# EasyEDA Pro project ProProject_Driver_STM32F031_2023-10-07.epro, board PCB1
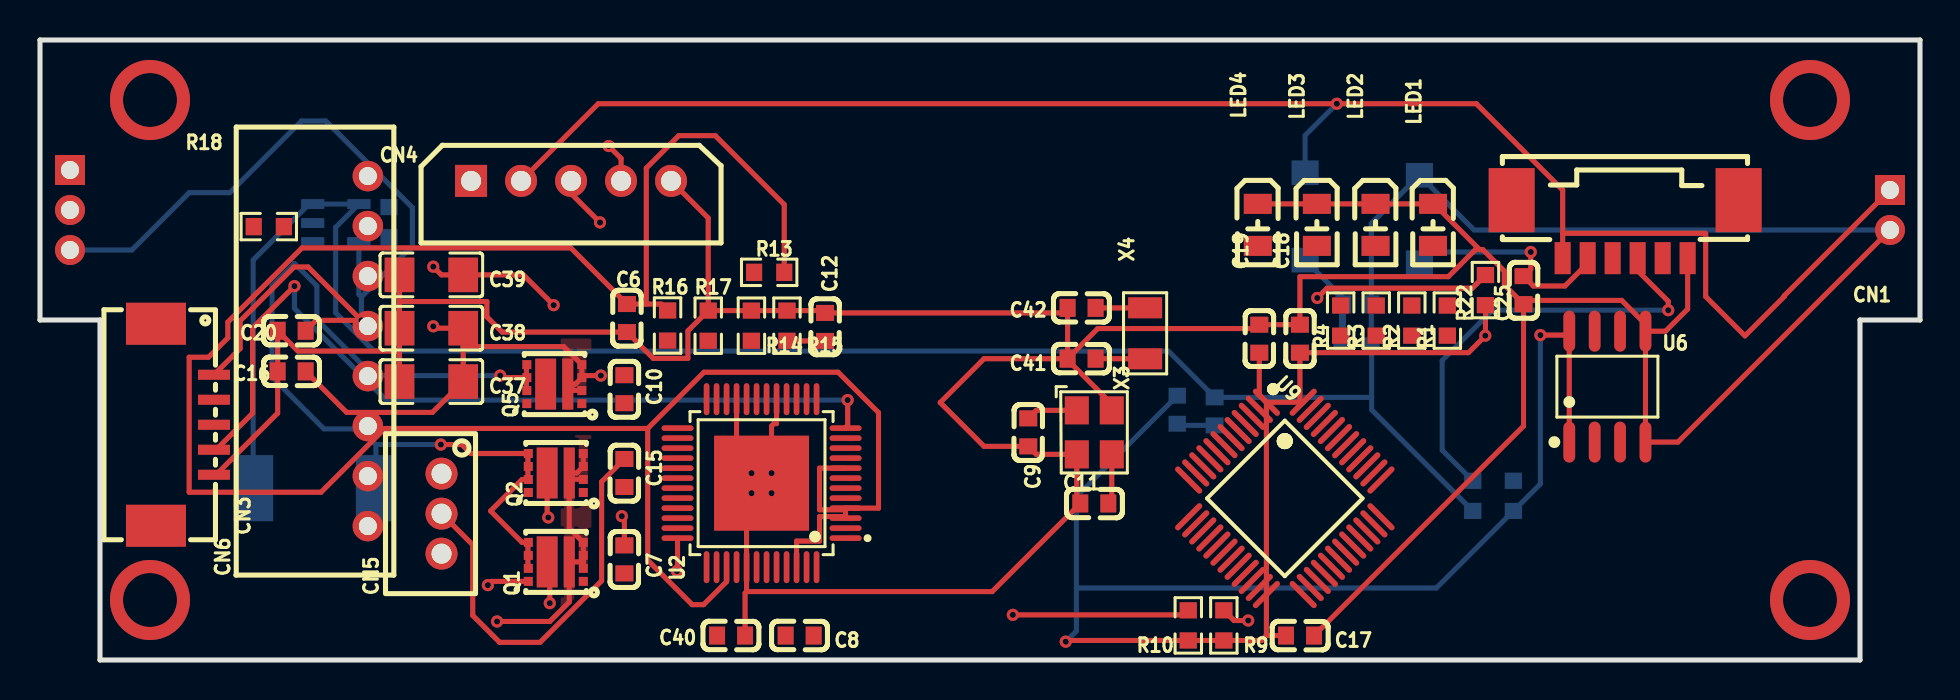
[diagram p8: board, top side]
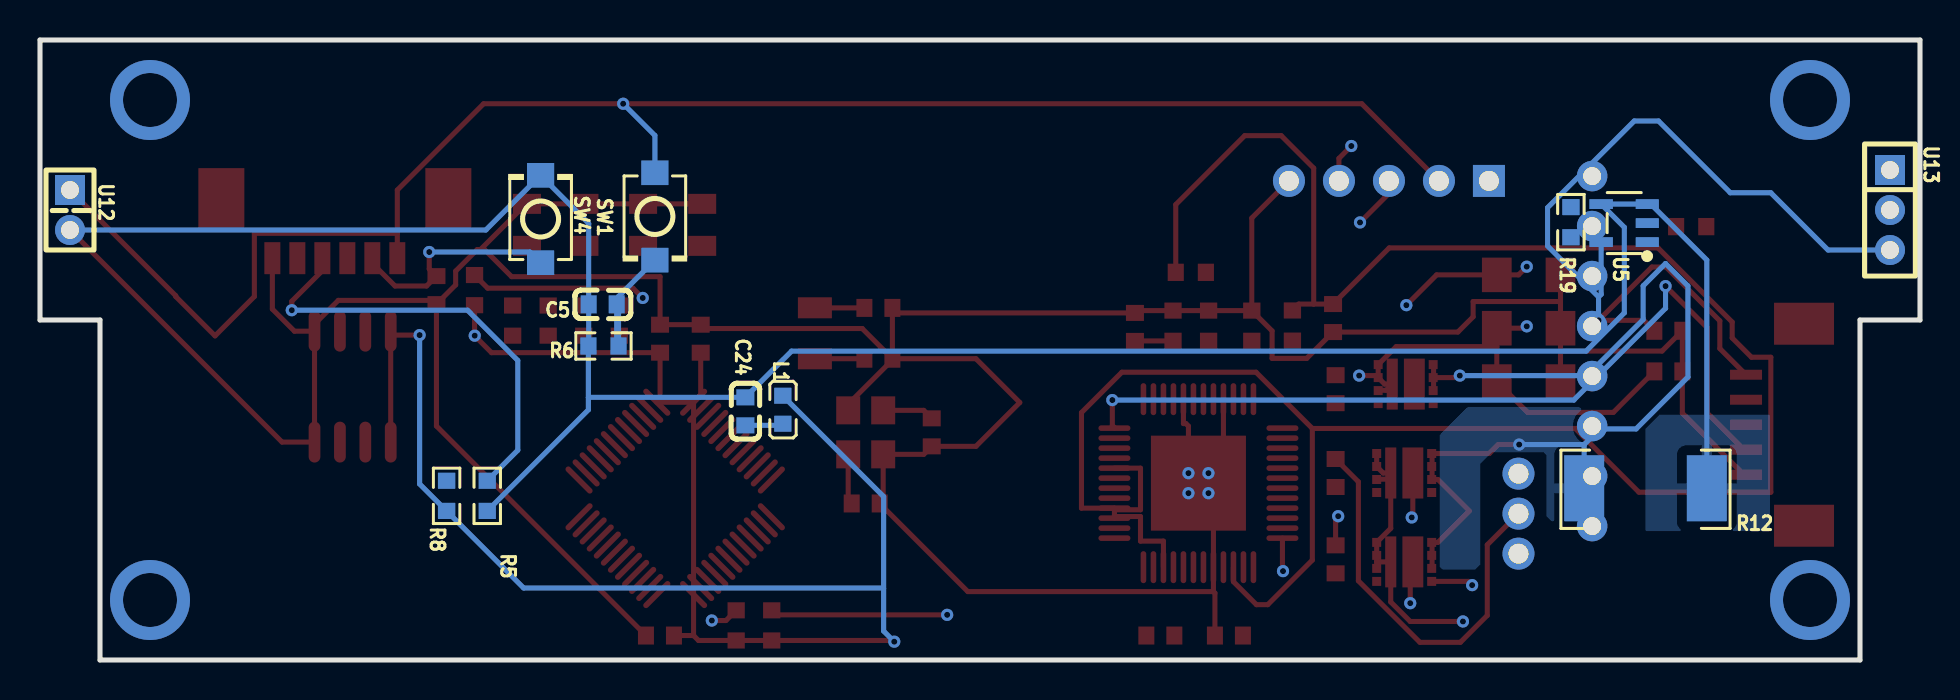
[diagram p9: board, bottom side, seen from below]

Outline 94 x 31 mm; copper layers: Top Layer, Inner1, Inner2, Bottom Layer. Coordinates in mm from the lower left corner of the outline.
Outline path: 0,31 94,31 94,17 91,17 91,0 3,0 3,17 0,17 0,31
Stack: Top Layer 0.035mm / Dielectric1 0.48mm PP er 4.5 / Inner1 0.035mm / Dielectric2 0.48mm FR4 er 4.5 / Inner2 0.035mm / Dielectric3 0.48mm PP er 4.5 / Bottom Layer 0.035mm

## Design rules (mm)
spacing safeClearance (default): track to track 0.152, other pairs 0.152 to 0.3
track width trackWidth (default): min 0.127, default 0.254, max 2.54
differential pair differentialPair (default): width min 0.127, default 0.254, max 2.54; gap min 0.152, default 0.152
via viaSize (default): diameter min 0.5, default 0.61, max 10; hole min 0.3, default 0.305, max 6
net GND uses copperRegion1
net VCC uses copperRegion1
net GND_CS uses copperRegion1
net +16V uses copperRegion1

## Placement (name value [footprint] x y rotation side)
C5  100nF  [C0603]  65.87 17.78 0 bottom
C6  1uF  [C0603]  29.35 17.1 90 top
C7  33nF  [C0603]  29.22 5.03 90 top
C8  470nF  [C0603]  37.98 1.22 0 top
C9  20pF  [C0603]  49.41 11.38 90 top
C10  33nF  [C0603]  29.22 13.54 90 top
C11  20pF  [C0603]  52.72 7.83 180 top
C12  1nF  [C0603]  39.25 16.65 270 top
C15  33nF  [C0603]  29.22 9.35 90 top
C16  10uF  [C0603]  12.58 14.43 0 top
C17  100nF  [C0603]  63 1.22 180 top
C18  100nF  [C0603]  63 16.07 270 top
C19  100nF  [C0603]  60.96 16.07 270 top
C20  4.7uF  [C0603]  12.58 16.46 0 top
C24  100nF  [C0603]  58.73 12.43 270 bottom
C25  100nF  [C0603]  74.18 18.49 90 top
C37  10uF  [C1206]  19.57 13.92 0 top
C38  10uF  [C1206]  19.57 16.59 0 top
C39  10uF  [C1206]  19.57 19.26 0 top
C40  1uF  [C0603]  34.55 1.22 0 top
C41  22pF  [C0603]  52.08 15.06 0 top
C42  22pF  [C0603]  52.08 17.61 0 top
CN1  532610671  [CONN-SMD_6P-P1.25_53261-0671]  79.26 21.54 180 top
CN3  1.25-5P WT  [CONN-SMD_1.25-5PWT]  7.25 11.76 90 top
CN4  5264-5A  [CONN-TH_5264-5A]  26.55 23.95 0 top
CN5  B3B-PH-K-S(LF)(SN)  [CONN-TH_B3B-PH-K-S]  20.08 7.32 90 top
CN6  22057085  [CONN-TH_8P-P2.50_MOLEX_22057085]  16.39 15.45 90 top
L1  3.3uH  [L0603]  56.86 12.51 270 bottom
LED1  SZYY0805B  [LED0805-R-RD_BLUE]  69.65 21.76 270 top
LED2  SZYY0805B  [LED0805-R-RD_BLUE]  66.78 21.76 270 top
LED3  SZYY0805B  [LED0805-R-RD_BLUE]  63.84 21.76 270 top
LED4  SZYY0805B  [LED0805-R-RD_BLUE]  60.89 21.76 270 top
Q1  DMT3009LDT-7  [V-DFN3030-8K_L3.0-W3.0-P0.65-BL]  25.79 4.91 90 top
Q2  DMT3009LDT-7  [V-DFN3030-8K_L3.0-W3.0-P0.65-BL]  25.79 9.35 90 top
Q5  DMT3009LDT-7  [V-DFN3030-8K_L3.0-W3.0-P0.65-BL]  25.72 13.8 90 top
R1  1kΩ  [R0603]  70.37 16.97 270 top
R2  1kΩ  [R0603]  68.59 16.97 270 top
R3  1kΩ  [R0603]  66.81 16.97 270 top
R4  1kΩ  [R0603]  65.03 16.97 270 top
R5  10kΩ  [R0603]  71.64 8.21 90 bottom
R6  10kΩ  [R0603]  65.83 15.7 0 bottom
R8  10kΩ  [R0603]  73.67 8.21 90 bottom
R9  1kΩ  [R0603]  59.19 1.73 90 top
R10  1kΩ  [R0603]  57.41 1.73 90 top
R12  25mΩ  [RES-SMD_L6.4-W3.2-R2512]  13.73 8.59 0 bottom
R13  47kΩ  [R0603]  37.35 16.72 270 top
R14  10kΩ  [R0603]  35.57 16.72 90 top
R15  100kΩ  [R0603]  36.46 19.38 180 top
R16  100kΩ  [R0603]  31.38 16.72 270 top
R17  10kΩ  [R0603]  33.41 16.72 270 top
R18  1kΩ  [R0603]  11.44 21.67 0 top
R19  1kΩ  [R0603]  17.45 21.89 90 bottom
R22  10kΩ  [R0603]  72.27 18.49 270 top
SW1  TS-1088-AR02016  [SW-SMD_L3.9-W3.0-P4.45]  63.26 22.18 270 bottom
SW4  TS-1088-AR02016  [SW-SMD_L3.9-W3.0-P4.45]  68.97 22.05 90 bottom
U2  A3930KJPTR-T  [LQFP-48_L7.0-W7.0-P0.50-LS9.0-BL-EP]  36.08 8.84 90 top
U5  TPS7B6950DBVR  [SOT-23-5_L3.0-W1.7-P0.95-LS2.8-BL]  14.79 21.84 90 bottom
U6  π122U31  [SOIC-8_L4.9-W3.9-P1.27-LS6.0-BL]  78.37 13.67 0 top
U9  STM32F031C6T6TR  [LQFP-48_L7.0-W7.0-P0.50-LS9.0-TL]  62.24 8.08 315 top
U12  DW200R-11-02-43  [HDR-TH_2P-P2.00-V-F]  92.5 22.5 270 bottom
U13  PM200-1-03-Z-4.3  [HDR-TH_3P-P2.00-V-F-A]  1.5 22.5 270 bottom
X3  8MHz  [OSC-SMD_4P-L3.2-W2.5-BL]  52.72 11.38 270 top
X4  32.768kHz  [CRYSTAL-SMD_L3.2-W1.5-1]  55.25 16.33 90 top

## Footprints (pads in the part's own frame, mm; a bottom-side part is the same pattern mirrored in y, then rotated)
C0603
  rect 0.8x0.9 smd: 1(-0.7,0) 2(0.7,0)
C1206
  rect 1.485x1.728 smd: 1(-1.593,0) 2(1.593,0)
CONN-SMD_1.25-5PWT
  rect 0.5x1.6 smd: 1(2.5,-1.45) 2(1.25,-1.45) 3(0,-1.45) 4(-1.25,-1.45) 5(-2.5,-1.45)
  rect 2.1x3 smd: 6(5.05,1.45) 7(-5.05,1.45)
CONN-SMD_6P-P1.25_53261-0671
  rect 0.8x1.6 smd: 1(3.124,1.45) 2(1.875,1.45) 3(0.625,1.45) 4(-0.625,1.45) 5(-1.875,1.45) 6(-3.124,1.45)
  rect 2.301x3.2 smd: 7(-5.675,-1.45) 8(5.675,-1.45)
CONN-TH_8P-P2.50_MOLEX_22057085
  round 1.524 hole 0.9: 1(-8.75,0) 2(-6.25,0) 3(-3.75,0) 4(-1.25,0) 5(1.25,0) 6(3.75,0) 7(6.25,0) 8(8.75,0)
CONN-TH_5264-5A
  rect 1.6x1.6 hole 1: 1(-5,0)
  round 1.6 hole 1: 2(-2.5,0) 3(0,0) 4(2.5,0) 5(5,0)
CONN-TH_B3B-PH-K-S
  round 1.6 hole 1: 1(2,0) 2(0,0) 3(-2,0)
CRYSTAL-SMD_L3.2-W1.5-1
  rect 1.05x1.7 smd: 1(-1.275,0) 2(1.275,0)
HDR-TH_2P-P2.00-V-F
  rect 1.5x1.5 hole 0.9: 1(-1,0)
  round 1.5 hole 0.9: 2(1,0)
HDR-TH_3P-P2.00-V-F-A
  rect 1.5x1.5 hole 0.9: 1(-2,0)
  round 1.5 hole 0.9: 2(0,0) 3(2,0)
L0603
  rect 0.8x0.864 smd: 1(-0.7,0) 2(0.7,0)
LED0805-R-RD_BLUE
  rect 1.001x1.399 smd: 1(1.052,0) 2(-1.049,0)
LQFP-48_L7.0-W7.0-P0.50-LS9.0-BL-EP
  oval 0.28x1.6 smd: 1(-2.75,-4.2) 2(-2.25,-4.2) 3(-1.75,-4.2) 4(-1.25,-4.2) 5(-0.75,-4.2) 6(-0.25,-4.2) 7(0.25,-4.2) 8(0.75,-4.2) 9(1.25,-4.2) 10(1.75,-4.2) 11(2.25,-4.2) 12(2.75,-4.2) 25(2.75,4.2) 26(2.25,4.2) 27(1.75,4.2) 28(1.25,4.2) 29(0.75,4.2) 30(0.25,4.2) 31(-0.25,4.2) 32(-0.75,4.2) 33(-1.25,4.2) 34(-1.75,4.2) 35(-2.25,4.2) 36(-2.75,4.2)
  oval 1.6x0.28 smd: 13(4.2,-2.75) 14(4.2,-2.25) 15(4.2,-1.75) 16(4.2,-1.25) 17(4.2,-0.75) 18(4.2,-0.25) 19(4.2,0.25) 20(4.2,0.75) 21(4.2,1.25) 22(4.2,1.75) 23(4.2,2.25) 24(4.2,2.75) 37(-4.2,2.75) 38(-4.2,2.25) 39(-4.2,1.75) 40(-4.2,1.25) 41(-4.2,0.75) 42(-4.2,0.25) 43(-4.2,-0.25) 44(-4.2,-0.75) 45(-4.2,-1.25) 46(-4.2,-1.75) 47(-4.2,-2.25) 48(-4.2,-2.75)
  rect 4.75x4.75 smd: 49(0,0)
LQFP-48_L7.0-W7.0-P0.50-LS9.0-TL
  oval 1.8x0.28 smd: 1(-4.05,2.75) 2(-4.05,2.25) 3(-4.05,1.75) 4(-4.05,1.25) 5(-4.05,0.75) 6(-4.05,0.25) 7(-4.05,-0.25) 8(-4.05,-0.75) 9(-4.05,-1.25) 10(-4.05,-1.75) 11(-4.05,-2.25) 12(-4.05,-2.75) 25(4.05,-2.75) 26(4.05,-2.25) 27(4.05,-1.75) 28(4.05,-1.25) 29(4.05,-0.75) 30(4.05,-0.25) 31(4.05,0.25) 32(4.05,0.75) 33(4.05,1.25) 34(4.05,1.75) 35(4.05,2.25) 36(4.05,2.75)
  oval 0.28x1.8 smd: 13(-2.75,-4.05) 14(-2.25,-4.05) 15(-1.75,-4.05) 16(-1.25,-4.05) 17(-0.75,-4.05) 18(-0.25,-4.05) 19(0.25,-4.05) 20(0.75,-4.05) 21(1.25,-4.05) 22(1.75,-4.05) 23(2.25,-4.05) 24(2.75,-4.05) 37(2.75,4.05) 38(2.25,4.05) 39(1.75,4.05) 40(1.25,4.05) 41(0.75,4.05) 42(0.25,4.05) 43(-0.25,4.05) 44(-0.75,4.05) 45(-1.25,4.05) 46(-1.75,4.05) 47(-2.25,4.05) 48(-2.75,4.05)
OSC-SMD_4P-L3.2-W2.5-BL
  rect 1.4x1.2 smd: 1(-1.1,-0.875) 2(1.1,-0.875) 3(1.1,0.875) 4(-1.1,0.875)
R0603
  rect 0.806x0.864 smd: 1(-0.753,0) 2(0.753,0)
RES-SMD_L6.4-W3.2-R2512
  rect 2x3.3 smd: 1(-3.067,0) 2(3.067,0)
SOIC-8_L4.9-W3.9-P1.27-LS6.0-BL
  oval 0.588x2.045 smd: 1(-1.905,-2.772) 2(-0.635,-2.772) 3(0.635,-2.772) 4(1.905,-2.772) 5(1.905,2.772) 6(0.635,2.772) 7(-0.635,2.772) 8(-1.905,2.772)
SOT-23-5_L3.0-W1.7-P0.95-LS2.8-BL
  rect 0.49x1.157 smd: 1(-0.95,-1.153) 2(0,-1.153) 3(0.95,-1.153)
  rect 0.49x1.175 smd: 4(0.95,1.153) 5(-0.95,1.153)
SW-SMD_L3.9-W3.0-P4.45
  rect 1.23x1.36 smd: 1(-2.185,0) 2(2.185,0)
V-DFN3030-8K_L3.0-W3.0-P0.65-BL
  rect 0.45x0.45 smd: 1(-0.975,-1.375) 2(-0.325,-1.375) 3(0.325,-1.375) 4(0.975,-1.375) 5(0.975,1.375) 6(0.325,1.375) 7(-0.325,1.375) 8(-0.975,1.375)
  rect 2.55x1.044 smd: 9(0,0.433)
  rect 2.55x0.556 smd: 10(0,-0.672)

## Nets
As in the schematic.

Pads without a net: CN1 3 7 8; CN3 6 7; CN6 1 2 3 4 5 6 7 8; U2 1 7 13 19 37 44 47 48; U5 2; U6 2 7; U9 2 11 20 25 26 27 28 29 30 31 32 33 35 36 38 39 45 46

## Via types
v1: diameter 0.61, hole 0.305, Top Layer to Bottom Layer, 34 vias
v2: diameter 4, hole 2.7, Top Layer to Bottom Layer, 4 vias

## Routing (per net, layer and track width the routed paths; a pad name or vN(x,y) marks a point on that pad's centre or on a via; arc(x,y) is an arc through that point)
+5V: length 45.6
  Top Layer w0.254: CN3.1 10.01,15.57 10.01,16.96 12.7,19.65 13.4,19.65 v1(16.07,16.98) 13.8,16.98 C20.2
  Bottom Layer w0.254: U5.5 15.94,18.28 16.07,18.15 ; 16.07,18.15 18.62,20.7 18.62,22.62 14.29,26.95 13.07,26.95 9.48,23.36 7.46,23.36 4.6,20.5 U13.3 ; 16.07,18.15 v1(16.07,16.98)
+16V: length 71.5
  Top Layer w0.254: 27.17,4.91 Q1.10 26.46,2.9 25.49,1.93 v1(22.85,1.93) ; 27.17,4.91 Q1.2 ; 27.17,4.91 Q1.3 Q1.4 26.46,6.58 26.46,9.04 ; 21.16,15.67 26.19,15.67 Q5.4 27.09,14.22 ; 21.16,15.67 C38.2 19.76,16.59 v1(19.66,16.68) ; 21.16,15.67 C37.2 19.62,12.38 15.33,12.38 C16.2 ; 26.46,9.04 27.15,9.04 Q2.2 ; 26.46,9.04 Q2.10 26.84,9.35 Q2.3 Q2.4 ; Q5.2 27.08,13.49 26.7,13.49 Q5.10 26.77,13.8 Q5.3 27.09,14.22 ; 27.09,14.22 v1(28.04,14.22) ; v1(19.66,19.67) 20.07,19.26 C39.2 24.17,19.26 v1(25.68,17.74)
  Inner1 w0.254: CN4.1 19.66,22.06 v1(19.66,19.67) ; v1(28.04,14.22) 28.04,4.48 25.49,1.93 v1(22.85,1.93) ; v1(19.66,16.68) 24.62,16.68 v1(25.68,17.74)
GND: length 342.9
  Top Layer w0.254: CN3.5 8.8,9.26 11.88,12.34 C16.1 C20.1 12.9,15.45 17.98,15.45 ; 35.33,3.42 35.25,3.35 C40.2 ; 35.33,3.42 U2.41 35.33,8.09 v1(35.58,8.34) ; 35.33,3.42 47.61,3.42 C11.2 51.84,8 X3.2 49.81,10.28 C9.1 47.2,10.68 45.01,12.87 47.2,15.06 C41.1 ; U2.17 36.83,11.82 36.7,11.82 36.58,11.7 v1(36.58,9.34) v1(35.58,9.34) ; R17.1 32.4,16.45 32.4,15.08 30.66,15.08 C6.1 23.11,16.4 22.34,17.16 22.34,17.92 17.98,17.92 ; R17.1 33.41,22.1 CN4.5 ; R17.1 R14.2 R13.1 39.14,17.47 C12.1 51.13,17.35 C42.1 C41.1 ; C37.1 17.98,15.45 ; 17.98,15.45 C38.1 17.98,17.92 ; U6.5 U6.4 81.9,10.9 U12.2 ; U6.5 81.28,16.44 82.38,17.55 CN1.6 ; U6.5 80.27,16.79 79.09,17.98 74.37,17.98 C25.1 ; C41.1 51.38,15 53.59,12.79 X3.4 ; C41.1 52.89,16.57 60.77,16.57 C19.1 C18.1 63,19.17 70.42,19.17 71.77,20.52 71.98,20.52 ; U2.21 34.83,10.09 v1(35.58,9.34) ; v1(35.58,8.34) U2.49 35.58,8.84 v1(35.58,9.34) ; v1(35.58,8.34) v1(36.58,8.34) ; C25.1 74.18,11.7 C17.1 ; C25.1 73.22,18.76 73.22,19.44 72.14,20.52 71.98,20.52 ; 71.98,20.52 69.69,22.81 LED1.2 LED2.2 LED3.2 LED4.2 ; 17.98,17.92 C39.1
  Bottom Layer w0.254: R5.1 66.58,12.51 66.58,13.13 ; R12.1 10.66,20 13.46,22.8 U5.3 U5.4 14.78,21.64 14.78,17.36 16.7,15.44 56.42,15.44 58.73,13.13 66.58,13.13 ; 66.58,13.13 R6.2 66.57,15.71 C5.2 66.57,21.83 SW4.2 71.71,21.5 U12.2
GND_CS: length 46.7
  Top Layer w0.254: 24.4,9.67 24.4,9.03 ; 24.4,9.67 24.4,10.33 ; 24.4,9.67 Q2.6 ; 24.4,9.03 Q2.7 ; 24.4,9.03 24.1,9.03 22.53,7.45 24.1,5.88 24.4,5.88 ; v1(20.04,10.77) 21.09,10.77 21.53,10.33 24.4,10.33 ; 24.32,14.12 24.32,13.49 24.34,13.47 ; 24.32,14.12 24.32,14.75 24.34,14.77 ; 24.32,14.12 23.11,14.12 v1(23.01,14.22) ; 24.32,14.12 24.34,14.12 ; 24.4,5.23 24.4,4.6 Q1.7 ; 24.4,5.23 24.4,5.88 ; 24.4,5.23 Q1.6 ; Q2.5 24.4,10.33 ; 24.4,5.88 Q1.5
  Bottom Layer w0.254: 16.79,10.77 R12.2 ; 16.79,10.77 v1(20.04,10.77) ; 16.79,10.77 16.01,11.55 14.2,11.55 11.6,14.15 11.6,18.7 12.72,19.83 13.84,18.7 13.84,17.02 16.64,14.22 v1(23.01,14.22)
VCC: length 196.3
  Top Layer w0.254: 63,12.89 C18.2 71.42,15.37 72.27,16.22 ; 63,12.89 U9.48 ; 63,12.89 U9.1 ; C19.2 60.96,13.24 U9.1 ; 76.13,21.33 76.13,23.5 71.82,27.81 v1(64.84,27.81) 27.91,27.81 CN4.2 ; 76.13,21.33 83.28,21.33 83.28,18.17 85.25,16.21 87.21,18.17 87.21,18.21 U12.1 ; 76.13,21.33 CN1.1 ; U9.1 U9.24 61.32,1.22 ; v1(51.29,0.92) 51.35,0.98 R10.1 R9.1 61.08,0.98 61.32,1.22 ; 61.32,1.22 C17.2 ; 76.46,16.25 U6.8 ; 76.46,16.25 U6.1 ; 76.46,16.25 v1(75.02,16.25) ; v1(72.26,16.22) 72.27,16.22 ; 72.27,16.22 R22.2
  Inner1 w0.254: v1(72.26,16.22) 64.84,23.64 v1(64.84,27.81)
  Bottom Layer w0.254: SW1.1 63.26,26.23 v1(64.84,27.81) ; v1(51.29,0.92) 51.82,1.45 51.82,3.6 ; 51.82,3.6 69.81,3.6 R8.1 75.02,8.8 v1(75.02,16.25) ; 51.82,3.6 51.82,8.17 56.86,13.21
VDDA: length 1.9
  Bottom Layer w0.254: 56.86,11.81 56.94,11.73 C24.2
(no net):
  vias: v1(5.5,28) v1(5.5,3) v1(88.5,28) v1(88.5,3) v2(5.5,28) v2(5.5,3) v2(88.5,28) v2(88.5,3)
32_IN: length 2.5
  Top Layer w0.254: X4.2 55.25,17.61 C42.2
32_OUT: length 2.5
  Top Layer w0.254: C41.2 55.25,15.06 X4.1
A_OUT: length 16
  Top Layer w0.254: C7.2 29.22,7.06 v1(29.09,7.19) ; v1(25.49,2.84) 25.49,4.77 Q1.9
  Inner1 w0.254: CN5.3 20.08,5.15 22.38,2.84 v1(25.49,2.84)
  Inner2 w0.254: v1(29.09,7.19) 29.09,6.44 v1(25.49,2.84)
B_OUT: length 28.2
  Top Layer w0.254: v1(25.41,7.13) 25.36,7.18 Q2.9 ; CN5.2 21.64,5.76 21.64,2.23 22.98,0.88 25,0.88 28.08,3.96 28.08,8.91 C15.2
  Inner2 w0.254: v1(25.41,7.13) 20.27,7.13 CN5.2
BOOT0: length 7.2
  Bottom Layer w0.254: C5.1 65.17,15.79 R6.1 65.07,18.17 SW1.2
GLA: length 31.8
  Top Layer w0.254: U2.36 31.88,4.47 v1(31.85,4.44) ; v1(22.39,3.74) 22.58,3.93 Q1.8
  Inner1 w0.254: v1(31.85,4.44) 31.85,13.02 28.89,15.98 26.25,13.34 26.25,7.05 22.94,3.74 v1(22.39,3.74)
HC: length 42
  Top Layer w0.254: v1(40.38,13) 40.38,11.72 40.28,11.62 U2.12 ; v1(12.72,18.69) 10.63,16.6 10.63,12.34 8.8,10.51 CN3.4
  Bottom Layer w0.254: v1(12.72,18.69) 12.72,17.58 17.31,13 v1(40.38,13)
I2C1_SCL: length 49.5
  Top Layer w0.254: R10.2 57.19,2.26 v1(48.64,2.26) ; v1(28.43,25.7) 29.05,25.08 CN4.4
  Inner1 w0.254: v1(48.64,2.26) 48.64,9.1 37.93,19.81 28.65,19.81 27.22,21.24 27.22,22.67 27.83,22.67 28.43,23.28 v1(28.43,25.7)
I2C1_SDA: length 44.8
  Top Layer w0.254: v1(28,21.88) 26.55,23.32 CN4.3 ; v1(60.41,1.97) 59.7,1.97 R9.2
  Inner1 w0.254: v1(28,21.88) 40.5,21.88 v1(60.41,1.97)
NRST: length 31.8
  Top Layer w0.254: R22.1 71.62,18.59 64.35,18.59 v1(63.86,18.1) ; CN1.2 77.38,19.84 76.25,18.7 74.67,18.7 C25.2 74.54,19.55 v1(74.54,20.4)
  Inner2 w0.254: v1(63.86,18.1) 72.24,18.1 v1(74.54,20.4)
  Bottom Layer w0.254: SW4.1 69.51,20.4 v1(74.54,20.4)
OSC_IN: length 2.6
  Top Layer w0.254: X3.1 49.81,12.48 C9.2
OSC_OUT: length 2.5
  Top Layer w0.254: X3.3 53.59,8 C11.1
SWCLK: length 22.2
  Top Layer w0.254: CN1.4 79.88,19.46 81.41,17.94 v1(81.41,17.49)
  Bottom Layer w0.254: v1(81.41,17.49) 72.62,17.49 70.11,14.98 70.11,10.49 R5.2
$1N6939: length 1.9
  Top Layer w0.254: R13.2 37.36,15.95 C12.2
$1N6958: length 120.9
  Top Layer w0.254: U2.46 37.83,5.94 38.97,5.94 38.97,7.17 40.28,7.17 ; 30.31,17.8 30.31,24.59 31.94,26.22 33.76,26.22 37.21,22.77 R15.1 ; 30.31,17.8 31.06,17.8 R16.1 ; 30.31,17.8 C6.2 26.54,20.61 13.1,20.61 9.39,16.9 9.39,16.1 8.42,15.14 7.46,15.14 7.46,8.39 14.05,8.39 17.24,11.58 30.38,11.58 ; 30.38,11.58 30.38,5 32.61,2.77 33.18,2.77 34.33,3.92 U2.39 ; 30.38,11.58 33.2,14.39 39.91,14.39 41.93,12.37 41.93,7.59 U2.4 40.28,7.51 ; 40.28,7.17 U2.3 ; 40.28,7.17 40.28,7.51 ; 40.28,7.51 38.97,7.51 38.97,9.59 U2.8

## Copper pours and planes (outline as drawn; the poured copper is in the pictures)
+16V on Top Layer: 26.04,16.97 27.57,16.97 27.57,1.91 26.04,1.91
GND on Bottom Layer: 7.5,12.27 13.73,12.27 13.73,6.44 7.5,6.44
GND on Inner1: -2.15,32.97 95.01,32.97 95.01,-1.83 -2.15,-1.83
GND_CS on Bottom Layer: 17.03,12.65 22.62,12.65 24.01,11.25 24.01,4.65 23.89,4.52 22.23,4.52 21.98,4.78 21.98,9.81 21.4,10.39 18.83,10.39 18.68,10.24 18.68,7.19 18.42,6.94 15.76,6.94 15.5,7.19 15.5,11.13
VCC on Inner2: -6.34,31.96 97.29,31.96 97.29,-0.56 -6.34,-0.56
